# Altium schematic sheet MB1936-TOP.SchDoc: TOP
size A3; Date: Not used; ApprovedBy: Not used; CheckedBy: Not used; Author: Not used; CompanyName: STMicroelectronics; DrawnBy: Not used; Engineer: Not used; Organization: Not used; Address1: Not used; Address2: Not used; Address3: Not used; Address4: Not used; DocumentNumber: Not used; Revision: Not used; SheetNumber: 2; SheetTotal: 18; CurrentTime: Not used; CurrentDate: Not used; Time: Not used; DocumentFullPathAndName: Not used; DocumentName: Not used; ModifiedDate: Not used; ImagePath: Not used; ProjectName: Not used; Application_BuildNumber: Not used
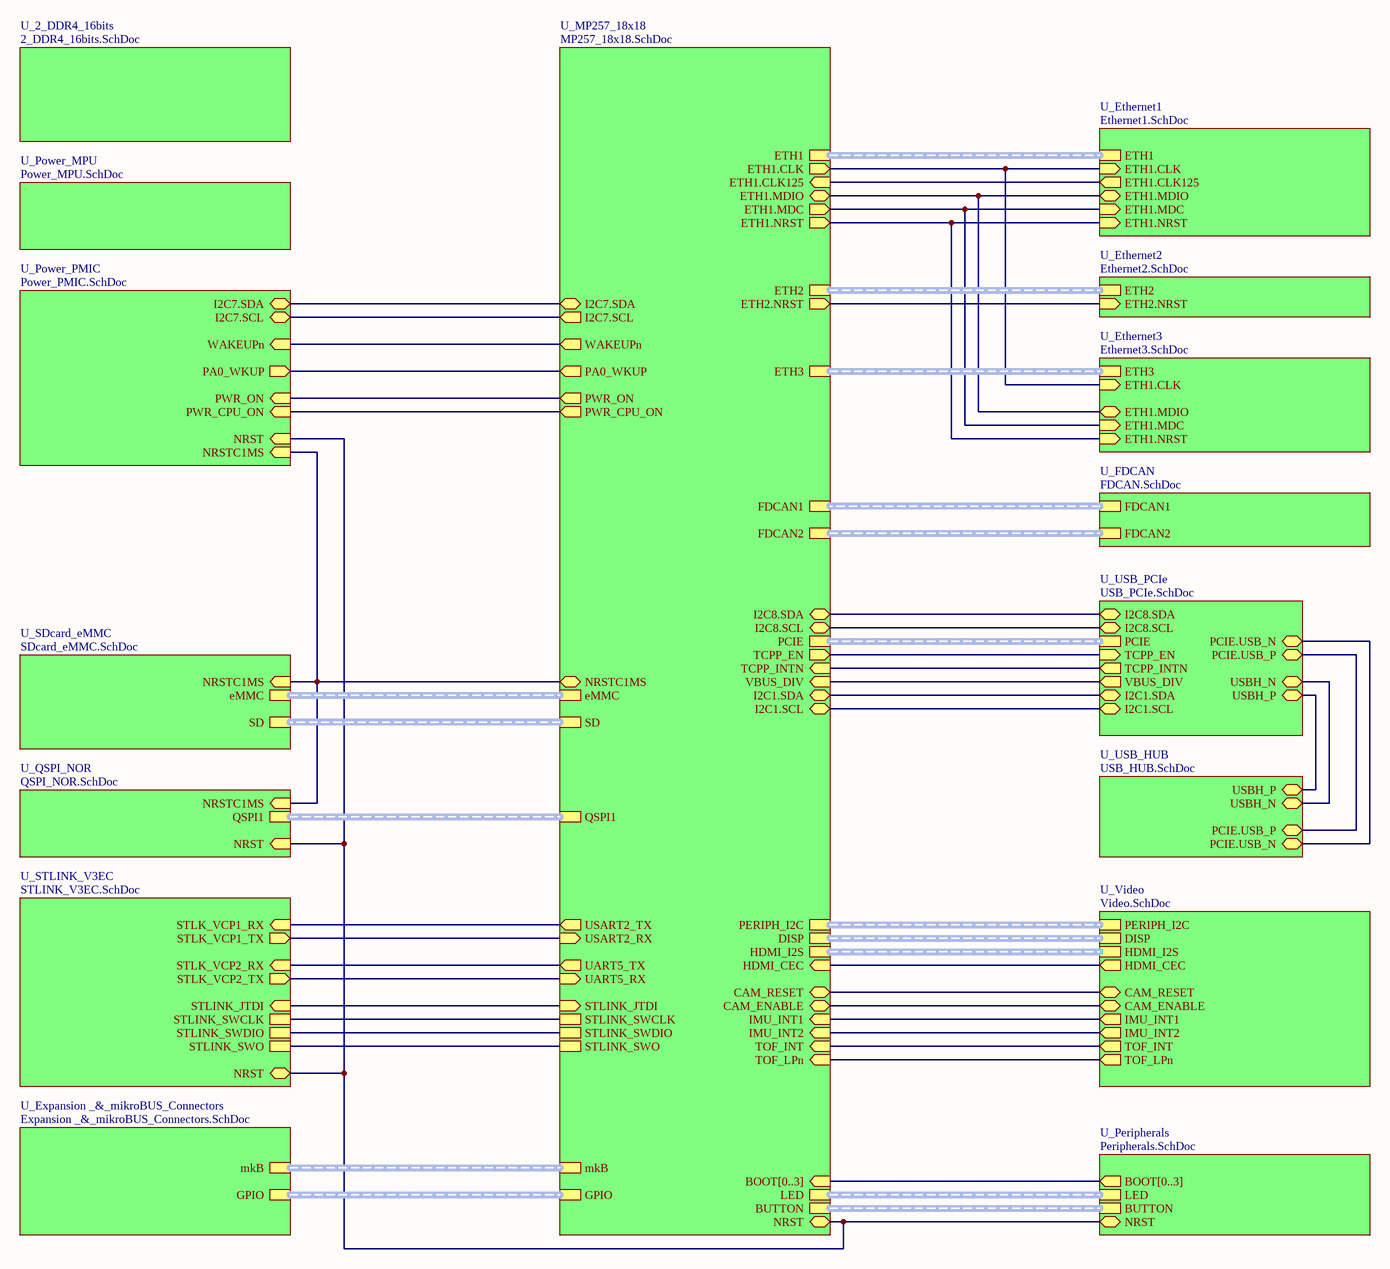
[diagram p0: MB1936-TOP.SchDoc]

## Sub-sheets
U_2_DDR4_16bits = 2_DDR4_16bits.SchDoc: no entries
U_Ethernet1 = Ethernet1.SchDoc: ETH1.NRST (in), ETH1 (harness ETH1), ETH1.CLK (in), ETH1.MDC (in), ETH1.MDIO (bidir), ETH1.CLK125 (out)
U_Ethernet2 = Ethernet2.SchDoc: ETH2.NRST (in), ETH2 (harness ETH2)
U_Ethernet3 = Ethernet3.SchDoc: ETH1.NRST (in), ETH3 (harness ETH3), ETH1.CLK (in), ETH1.MDIO (bidir), ETH1.MDC (in)
U_Expansion _&_mikroBUS_Connectors = Expansion _&_mikroBUS_Connectors.SchDoc: GPIO (harness GPIO), mkB (harness mikroBUS)
U_FDCAN = FDCAN.SchDoc: FDCAN2 (harness FDCAN2), FDCAN1 (harness FDCAN1)
U_MP257_18x18 = MP257_18x18.SchDoc: SD (harness SD), eMMC (harness eMMC), ETH1 (harness ETH1), ETH3 (harness ETH3), HDMI_CEC (in), ETH2 (harness ETH2), ETH1.NRST (out), PWR_ON (out), NRST (bidir), FDCAN1 (harness FDCAN1), FDCAN2 (harness FDCAN2), LED (harness LED), BOOT[0..3] (in), UART5_RX (in), UART5_TX (out), QSPI1 (harness QSPI), GPIO (harness GPIO), HDMI_I2S (harness HDMI_I2S), PERIPH_I2C (harness PERIPH_I2C), TCPP_INTN (in), I2C7.SDA (bidir), USART2_TX (out), I2C7.SCL (out), USART2_RX (in), VBUS_DIV (in), ETH1.MDIO (bidir), ETH1.CLK125 (in), ETH1.MDC (out), ETH1.CLK (out), PCIE (harness PCIE), STLINK_JTDI (in), STLINK_SWCLK, STLINK_SWDIO, STLINK_SWO, DISP (harness DISP), I2C1.SDA (bidir), I2C1.SCL (bidir), NRSTC1MS (bidir), PWR_CPU_ON (out), TOF_INT (in), CAM_ENABLE (bidir), IMU_INT1 (in), IMU_INT2 (in), TOF_LPn (in), CAM_RESET (bidir), ETH2.NRST (out), I2C8.SDA (bidir), I2C8.SCL (bidir), BUTTON (harness BUTTON), PA0_WKUP (out), WAKEUPn (out), mkB (harness mikroBUS), TCPP_EN (out)
U_Peripherals = Peripherals.SchDoc: NRST (bidir), BOOT[0..3] (out), LED (harness LED), BUTTON (harness BUTTON)
U_Power_MPU = Power_MPU.SchDoc: no entries
U_Power_PMIC = Power_PMIC.SchDoc: PWR_CPU_ON (in), NRST (in), PWR_ON (in), I2C7.SDA (bidir), I2C7.SCL (bidir), WAKEUPn (in), NRSTC1MS (in), PA0_WKUP (out)
U_QSPI_NOR = QSPI_NOR.SchDoc: QSPI1 (harness QSPI), NRSTC1MS (in), NRST (in)
U_SDcard_eMMC = SDcard_eMMC.SchDoc: SD (harness SD), NRSTC1MS (in), eMMC (harness eMMC)
U_STLINK_V3EC = STLINK_V3EC.SchDoc: NRST (bidir), STLK_VCP2_TX (out), STLK_VCP2_RX (in), STLK_VCP1_TX (out), STLK_VCP1_RX (in), STLINK_SWCLK, STLINK_SWDIO, STLINK_JTDI (in), STLINK_SWO
U_USB_HUB = USB_HUB.SchDoc: USBH_P (bidir), USBH_N (bidir), PCIE.USB_P (bidir), PCIE.USB_N (bidir)
U_USB_PCIe = USB_PCIe.SchDoc: PCIE (harness PCIE), USBH_P (bidir), USBH_N (bidir), TCPP_INTN (out), I2C1.SDA (bidir), I2C1.SCL (bidir), VBUS_DIV (out), PCIE.USB_N (bidir), PCIE.USB_P (bidir), I2C8.SDA (bidir), I2C8.SCL (bidir), TCPP_EN (in)
U_Video = Video.SchDoc: CAM_RESET (bidir), HDMI_CEC (out), CAM_ENABLE (bidir), HDMI_I2S (harness HDMI_I2S), PERIPH_I2C (harness PERIPH_I2C), DISP (harness DISP), IMU_INT1 (out), TOF_INT (out), TOF_LPn (out), IMU_INT2 (out)

## Nets
(unnamed): sheet U_Video/CAM_RESET, sheet U_MP257_18x18/CAM_RESET
(unnamed): sheet U_Video/HDMI_CEC, sheet U_MP257_18x18/HDMI_CEC
(unnamed): sheet U_Video/CAM_ENABLE, sheet U_MP257_18x18/CAM_ENABLE
(unnamed): sheet U_Video/IMU_INT1, sheet U_MP257_18x18/IMU_INT1
(unnamed): sheet U_Video/TOF_INT, sheet U_MP257_18x18/TOF_INT
(unnamed): sheet U_Video/TOF_LPn, sheet U_MP257_18x18/TOF_LPn
(unnamed): sheet U_Video/IMU_INT2, sheet U_MP257_18x18/IMU_INT2
(unnamed): sheet U_SDcard_eMMC/NRSTC1MS, sheet U_MP257_18x18/NRSTC1MS, sheet U_QSPI_NOR/NRSTC1MS, sheet U_Power_PMIC/NRSTC1MS
(unnamed): sheet U_MP257_18x18/ETH1.NRST, sheet U_Ethernet1/ETH1.NRST, sheet U_Ethernet3/ETH1.NRST
(unnamed): sheet U_MP257_18x18/PWR_ON, sheet U_Power_PMIC/PWR_ON
(unnamed): sheet U_MP257_18x18/NRST, sheet U_Peripherals/NRST, sheet U_QSPI_NOR/NRST, sheet U_STLINK_V3EC/NRST, sheet U_Power_PMIC/NRST
(unnamed): sheet U_MP257_18x18/UART5_RX, sheet U_STLINK_V3EC/STLK_VCP2_TX
(unnamed): sheet U_MP257_18x18/UART5_TX, sheet U_STLINK_V3EC/STLK_VCP2_RX
(unnamed): sheet U_MP257_18x18/TCPP_INTN, sheet U_USB_PCIe/TCPP_INTN
(unnamed): sheet U_MP257_18x18/I2C7.SDA, sheet U_Power_PMIC/I2C7.SDA
(unnamed): sheet U_MP257_18x18/USART2_TX, sheet U_STLINK_V3EC/STLK_VCP1_RX
(unnamed): sheet U_MP257_18x18/I2C7.SCL, sheet U_Power_PMIC/I2C7.SCL
(unnamed): sheet U_MP257_18x18/USART2_RX, sheet U_STLINK_V3EC/STLK_VCP1_TX
(unnamed): sheet U_MP257_18x18/VBUS_DIV, sheet U_USB_PCIe/VBUS_DIV
(unnamed): sheet U_MP257_18x18/ETH1.MDIO, sheet U_Ethernet1/ETH1.MDIO, sheet U_Ethernet3/ETH1.MDIO
(unnamed): sheet U_MP257_18x18/ETH1.CLK125, sheet U_Ethernet1/ETH1.CLK125
(unnamed): sheet U_MP257_18x18/ETH1.MDC, sheet U_Ethernet1/ETH1.MDC, sheet U_Ethernet3/ETH1.MDC
(unnamed): sheet U_MP257_18x18/ETH1.CLK, sheet U_Ethernet1/ETH1.CLK, sheet U_Ethernet3/ETH1.CLK
(unnamed): sheet U_MP257_18x18/STLINK_JTDI, sheet U_STLINK_V3EC/STLINK_JTDI
(unnamed): sheet U_MP257_18x18/STLINK_SWCLK, sheet U_STLINK_V3EC/STLINK_SWCLK
(unnamed): sheet U_MP257_18x18/STLINK_SWDIO, sheet U_STLINK_V3EC/STLINK_SWDIO
(unnamed): sheet U_MP257_18x18/STLINK_SWO, sheet U_STLINK_V3EC/STLINK_SWO
(unnamed): sheet U_MP257_18x18/I2C1.SDA, sheet U_USB_PCIe/I2C1.SDA
(unnamed): sheet U_MP257_18x18/I2C1.SCL, sheet U_USB_PCIe/I2C1.SCL
(unnamed): sheet U_MP257_18x18/PWR_CPU_ON, sheet U_Power_PMIC/PWR_CPU_ON
(unnamed): sheet U_MP257_18x18/ETH2.NRST, sheet U_Ethernet2/ETH2.NRST
(unnamed): sheet U_MP257_18x18/I2C8.SDA, sheet U_USB_PCIe/I2C8.SDA
(unnamed): sheet U_MP257_18x18/I2C8.SCL, sheet U_USB_PCIe/I2C8.SCL
(unnamed): sheet U_MP257_18x18/PA0_WKUP, sheet U_Power_PMIC/PA0_WKUP
(unnamed): sheet U_MP257_18x18/WAKEUPn, sheet U_Power_PMIC/WAKEUPn
(unnamed): sheet U_MP257_18x18/TCPP_EN, sheet U_USB_PCIe/TCPP_EN
(unnamed): sheet U_USB_HUB/USBH_P, sheet U_USB_PCIe/USBH_P
(unnamed): sheet U_USB_HUB/USBH_N, sheet U_USB_PCIe/USBH_N
(unnamed): sheet U_USB_HUB/PCIE.USB_P, sheet U_USB_PCIe/PCIE.USB_P
(unnamed): sheet U_USB_HUB/PCIE.USB_N, sheet U_USB_PCIe/PCIE.USB_N

## Buses and harness runs
bus sheet U_MP257_18x18/BOOT[0..3] = sheet U_Peripherals/BOOT[0..3]
harness sheet U_Ethernet1/ETH1 = sheet U_MP257_18x18/ETH1
harness sheet U_Ethernet2/ETH2 = sheet U_MP257_18x18/ETH2
harness sheet U_Ethernet3/ETH3 = sheet U_MP257_18x18/ETH3
harness sheet U_Expansion _&_mikroBUS_Connectors/GPIO = sheet U_MP257_18x18/GPIO
harness sheet U_Expansion _&_mikroBUS_Connectors/mkB = sheet U_MP257_18x18/mkB
harness sheet U_FDCAN/FDCAN1 = sheet U_MP257_18x18/FDCAN1
harness sheet U_FDCAN/FDCAN2 = sheet U_MP257_18x18/FDCAN2
harness sheet U_MP257_18x18/BUTTON = sheet U_Peripherals/BUTTON
harness sheet U_MP257_18x18/DISP = sheet U_Video/DISP
harness sheet U_MP257_18x18/eMMC = sheet U_SDcard_eMMC/eMMC
harness sheet U_MP257_18x18/HDMI_I2S = sheet U_Video/HDMI_I2S
harness sheet U_MP257_18x18/LED = sheet U_Peripherals/LED
harness sheet U_MP257_18x18/PCIE = sheet U_USB_PCIe/PCIE
harness sheet U_MP257_18x18/PERIPH_I2C = sheet U_Video/PERIPH_I2C
harness sheet U_MP257_18x18/QSPI1 = sheet U_QSPI_NOR/QSPI1
harness sheet U_MP257_18x18/SD = sheet U_SDcard_eMMC/SD

## Notes on the sheet
- Title:
- Project:
- Size:
- Revision:
- Variant:
- A3
- -
- Date:
- Reference:
- Sheet:
- of